# EAGLE design Boobie LS2074M2G (EAGLE 7.7.0)
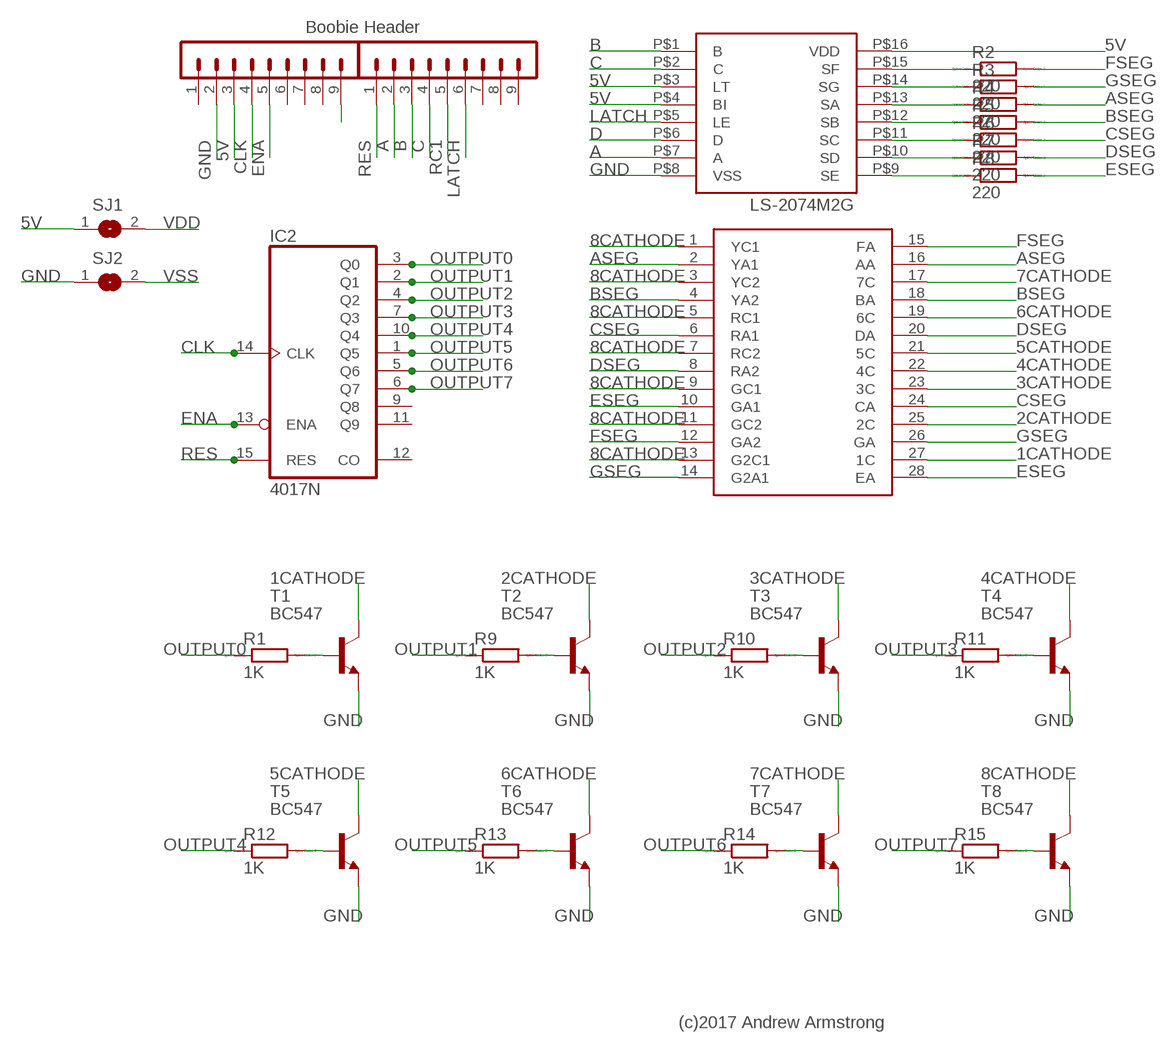
[diagram p0: schematic, sheet 1]

## Parts
IC2  4017N  [DIL16]
R1  1K  R0204/7  [0204/7]
R2  220  R0204/7  [0204/7]
R3  220  R0204/7  [0204/7]
R4  220  R0204/7  [0204/7]
R5  220  R0204/7  [0204/7]
R6  220  R0204/7  [0204/7]
R7  220  R0204/7  [0204/7]
R8  220  R0204/7  [0204/7]
R9  1K  R0204/7  [0204/7]
R10  1K  R0204/7  [0204/7]
R11  1K  R0204/7  [0204/7]
R12  1K  R0204/7  [0204/7]
R13  1K  R0204/7  [0204/7]
R14  1K  R0204/7  [0204/7]
R15  1K  R0204/7  [0204/7]
SJ1  SJ  [SJ]
SJ2  SJ  [SJ]
SV1  MA09-1  [MA09-1]
SV2  MA09-1  [MA09-1]
T1  BC547  [TO92]
T2  BC547  [TO92]
T3  BC547  [TO92]
T4  BC547  [TO92]
T5  BC547  [TO92]
T6  BC547  [TO92]
T7  BC547  [TO92]
T8  BC547  [TO92]
U$1  LS-2074M2G  [LS-2074M2G]
U$2  MC14511B  [DIL16]

## Nets
1CATHODE: T1.3(C) U$1.27(1C)
2CATHODE: T2.3(C) U$1.25(2C)
3CATHODE: T3.3(C) U$1.23(3C)
4CATHODE: T4.3(C) U$1.22(4C)
5CATHODE: T5.3(C) U$1.21(5C)
5V: SJ1.1 SV2.3 U$2.P$3(LT) U$2.P$4(BI) U$2.P$16(VDD)
6CATHODE: T6.3(C) U$1.19(6C)
7CATHODE: T7.3(C) U$1.17(7C)
8CATHODE: T8.3(C) U$1.1(YC1) U$1.3(YC2) U$1.5(RC1) U$1.7(RC2) U$1.9(GC1) U$1.11(GC2) U$1.13(G2C1)
A: SV1.2 U$2.P$7(A)
ASEG: R4.2 U$1.2(YA1) U$1.16(AA)
B: SV1.3 U$2.P$1(B)
BSEG: R5.2 U$1.4(YA2) U$1.18(BA)
C: SV1.4 U$2.P$2(C)
CLK: IC2.14(CLK) SV2.4
CSEG: R6.2 U$1.6(RA1) U$1.24(CA)
D: U$2.P$6(D)
DSEG: R7.2 U$1.8(RA2) U$1.20(DA)
ENA: IC2.13(ENA) SV2.5
ESEG: R8.2 U$1.10(GA1) U$1.28(EA)
FSEG: R2.2 U$1.12(GA2) U$1.15(FA)
GND: SJ2.1 SV2.2 T1.1(E) T2.1(E) T3.1(E) T4.1(E) T5.1(E) T6.1(E) T7.1(E) T8.1(E) U$2.P$8(VSS)
GSEG: R3.2 U$1.14(G2A1) U$1.26(GA)
LATCH: SV1.6 U$2.P$5(LE)
N$1: R9.2 T2.2(B)
N$2: SV2.9
N$3: R10.2 T3.2(B)
N$4: R11.2 T4.2(B)
N$5: R12.2 T5.2(B)
N$6: R13.2 T6.2(B)
N$8: R14.2 T7.2(B)
N$10: R15.2 T8.2(B)
N$16: R1.2 T1.2(B)
N$46: R2.1 U$2.P$15(SF)
N$47: R3.1 U$2.P$14(SG)
N$48: R4.1 U$2.P$13(SA)
N$49: R5.1 U$2.P$12(SB)
N$50: R6.1 U$2.P$11(SC)
N$51: R7.1 U$2.P$10(SD)
N$52: R8.1 U$2.P$9(SE)
OUTPUT0: IC2.3(Q0) R1.1
OUTPUT1: IC2.2(Q1) R9.1
OUTPUT2: IC2.4(Q2) R10.1
OUTPUT3: IC2.7(Q3) R11.1
OUTPUT4: IC2.10(Q4) R12.1
OUTPUT5: IC2.1(Q5) R13.1
OUTPUT6: IC2.5(Q6) R14.1
OUTPUT7: IC2.6(Q7) R15.1
RC1: SV1.5
RES: IC2.15(RES) SV1.1
VDD: SJ1.2
VSS: SJ2.2
Unconnected: IC2.9(Q8) IC2.11(Q9) IC2.12(CO) SV1.7 SV1.8 SV1.9 SV2.1 SV2.6 SV2.7 SV2.8

## Notes on the sheet
- Boobie Header
- (c)2017 Andrew Armstrong

## Power pins joined to a net without a drawn wire
VDD: IC2.16(VDD)
VSS: IC2.8(VSS)

## Library data of the parts
IC2 = 40xx:4017: COUNTER/DIVIDER
R1-R15 = eagle-ltspice:R: RESISTOR, European symbol; SPICEMODEL: NONE; SPICEPREFIX: R
SJ1 SJ2 = jumper:SJ: SMD solder JUMPER
SV1 SV2 = con-lstb:MA09-1: PIN HEADER; OC_FARNELL: unknown; OC_NEWARK: unknown
T1-T8 = transistor:BC547: NPN TRANSISTOR
U$1 = Backoffice Library:LS-2074M2G
U$2 = Backoffice Library:MC14511B

## Net classes
0 default: width 0.5 mm

## Board
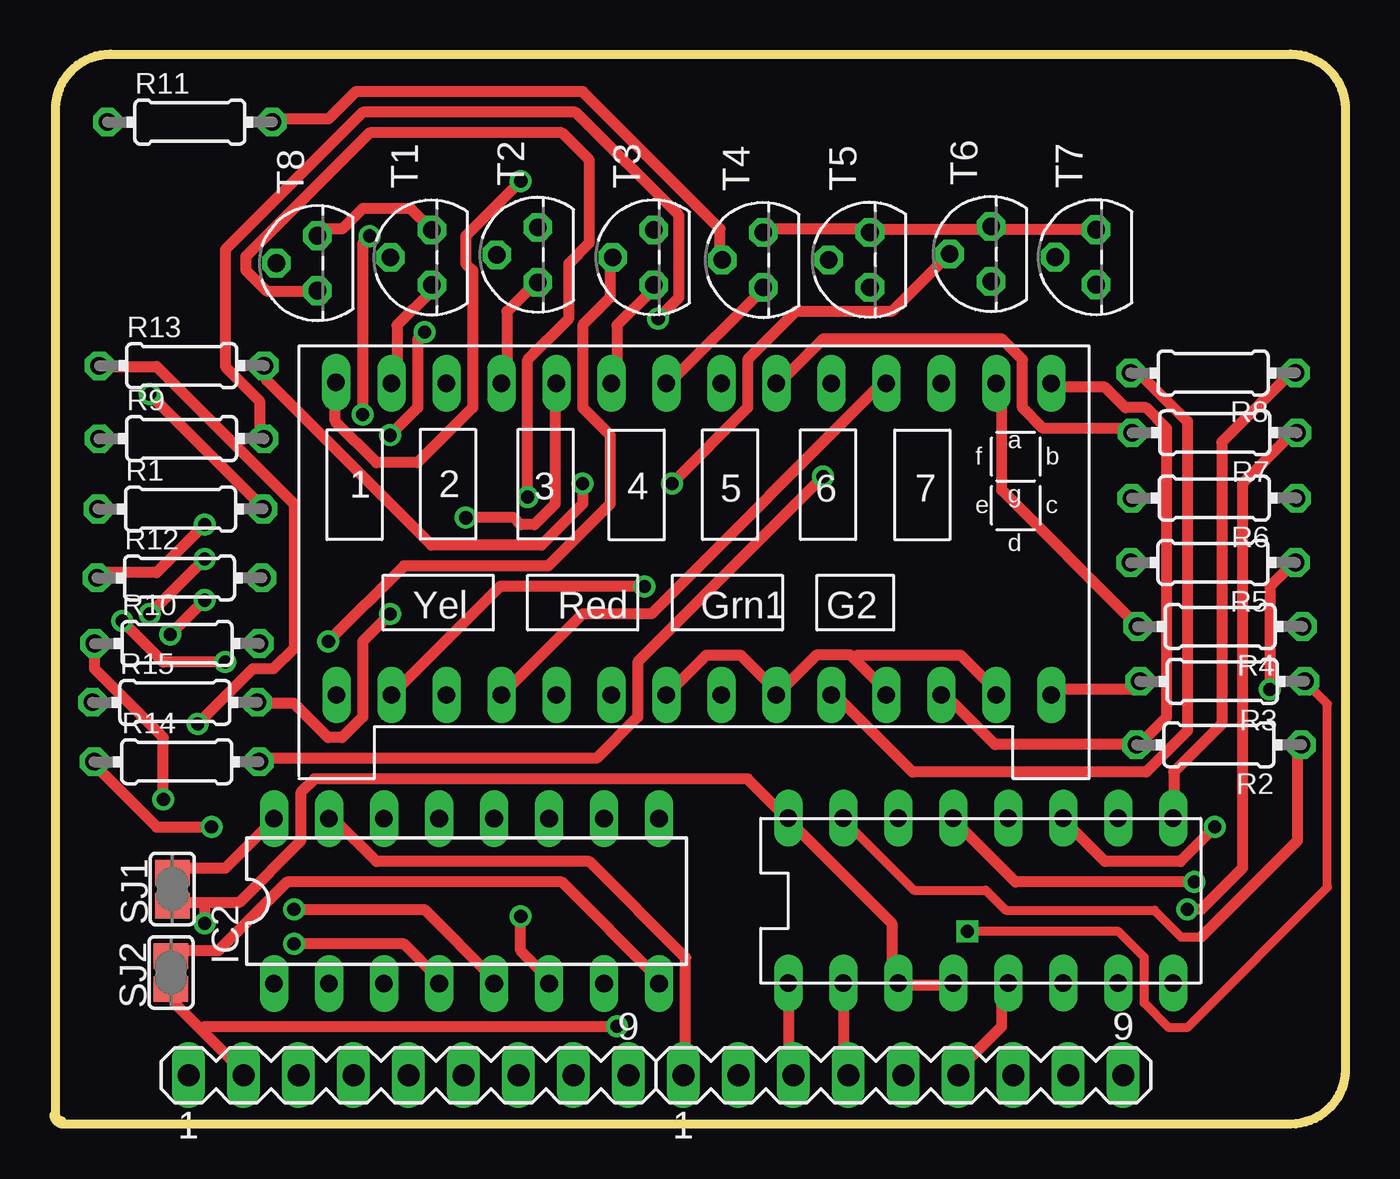
[diagram p1: board, top side]
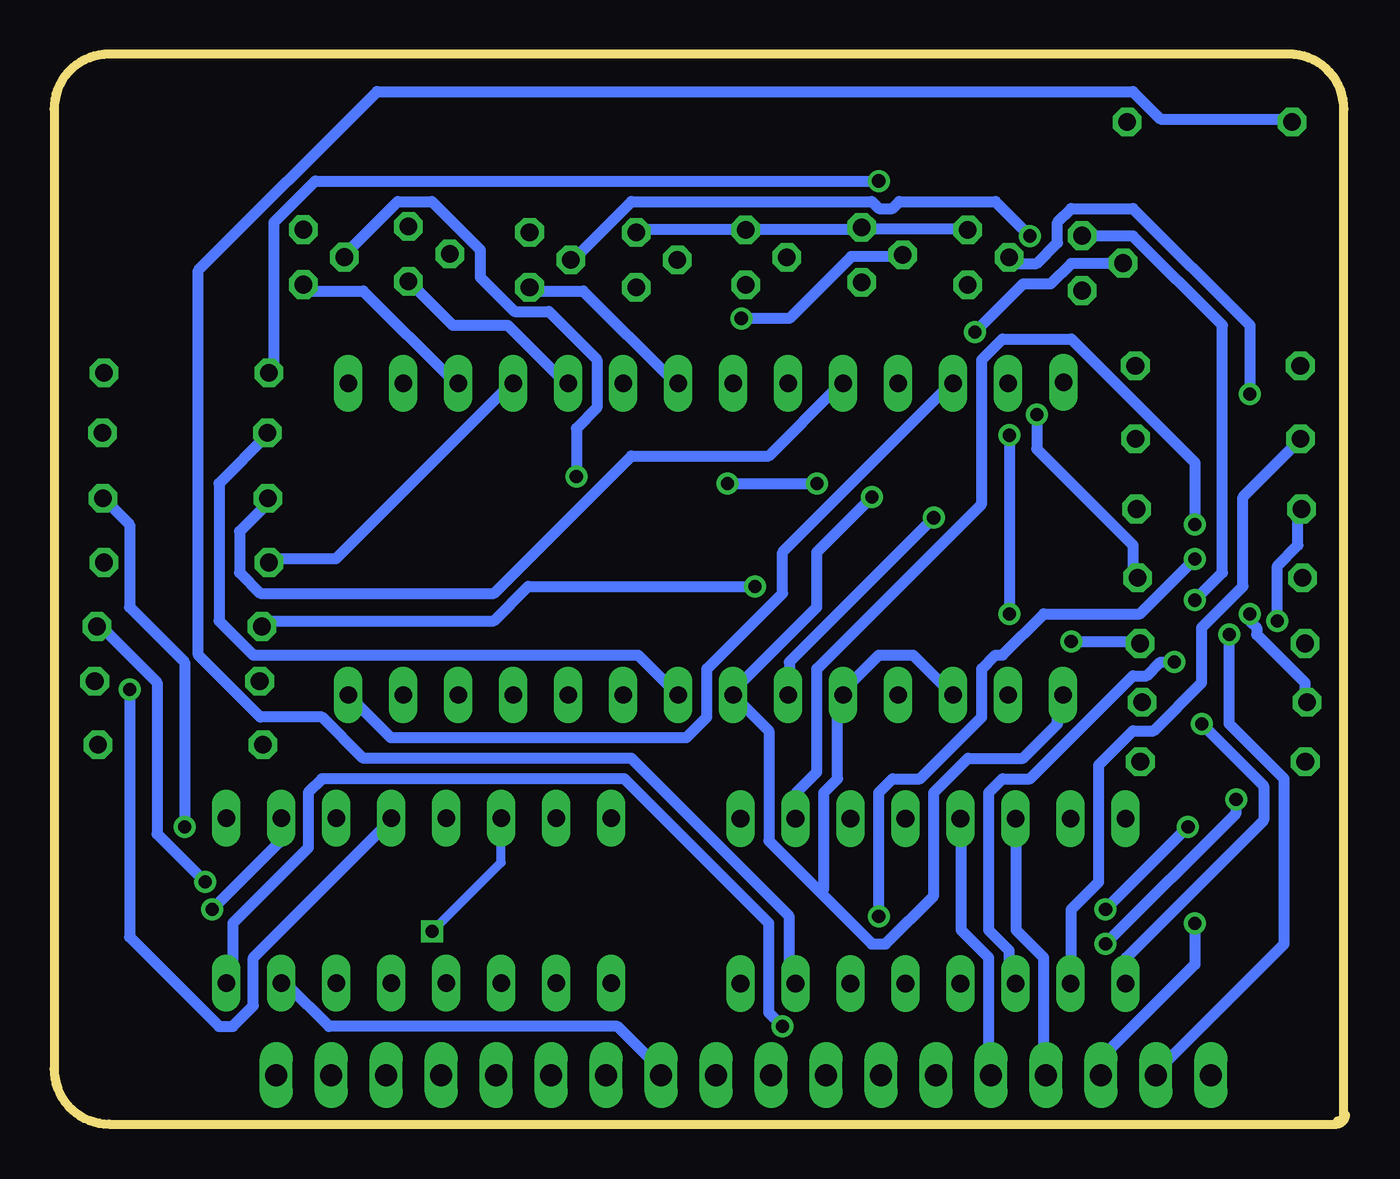
[diagram p2: board, bottom side, seen from below]

Size 59.65 x 49.43 mm. Coordinates in mm from the lower left corner, seen from the top.
Outline: 0.35,0.14 arc-90 0.07,0.43 0.07,46.89 arc-90 2.61,49.43 57.11,49.43 arc-90 59.65,46.89 59.65,2.54 arc-90 57.11,0 0.43,0 arc-90 0,0.43
Copper layers (1*16): Top 0.035mm / dielectric 1.5mm / Bottom 0.035mm
Design rules "default": minimum track width 10mil, minimum drill 24mil, track to track 8mil, track to pad 8mil, pad to pad 8mil, via to via 8mil, smd to smd 8mil, copper to edge 40mil, drill to drill 8mil, minimum pad ring 10mil, minimum via ring 8mil, stop-mask expansion 4mil, vias tented up to drill 0mil, thermal gap 10mil

### Footprints (pad centres in the part's own frame; a part is rotated, then mirrored left to right if it is on the bottom)
DIL16 = drill 0.813 long: 1 -8.89,-3.81; 2 -6.35,-3.81; 3 -3.81,-3.81; 4 -1.27,-3.81; 5 1.27,-3.81; 6 3.81,-3.81; 7 6.35,-3.81; 8 8.89,-3.81; 9 8.89,3.81; 10 6.35,3.81; 11 3.81,3.81; 12 1.27,3.81; 13 -1.27,3.81; 14 -3.81,3.81; 15 -6.35,3.81; 16 -8.89,3.81
0204/7 = drill 0.813 octagon: 1 -3.81,0; 2 3.81,0
SJ = smd 1.168 x 1.6: 1 -0.762,0; 2 0.762,0
MA09-1 = drill 1.016 long: 1 -10.16,0; 2 -7.62,0; 3 -5.08,0; 4 -2.54,0; 5 0,0; 6 2.54,0; 7 5.08,0; 8 7.62,0; 9 10.16,0
TO92 = drill 0.813 octagon: 1 1.27,0; 2 0,1.905; 3 -1.27,0
LS-2074M2G = drill 0.8 long: 1 1.74,-16.14; 2 4.28,-16.14; 3 6.82,-16.14; 4 9.36,-16.14; 5 11.9,-16.14; 6 14.44,-16.14; 7 16.98,-16.14; 8 19.52,-16.14; 9 22.06,-16.14; 10 24.6,-16.14; 11 27.14,-16.14; 12 29.68,-16.14; 13 32.22,-16.14; 14 34.76,-16.14; 15 34.76,-1.74; 16 32.22,-1.74; 17 29.68,-1.74; 18 27.14,-1.74; 19 24.6,-1.74; 20 22.06,-1.74; 21 19.52,-1.74; 22 16.98,-1.74; 23 14.44,-1.74; 24 11.9,-1.74; 25 9.36,-1.74; 26 6.82,-1.74; 27 4.28,-1.74; 28 1.72,-1.7
DIL16' = drill 0.8 long: P$1 -3.81,-3.81; P$2 -1.27,-3.81; P$3 1.27,-3.81; P$4 3.81,-3.81; P$5 6.35,-3.81; P$6 8.89,-3.81; P$7 11.43,-3.81; P$8 13.97,-3.81; P$9 13.97,3.81; P$10 11.43,3.81; P$11 8.89,3.81; P$12 6.35,3.81; P$13 3.81,3.81; P$14 1.27,3.81; P$15 -1.27,3.81; P$16 -3.81,3.81

### Placement (x,y rotation side)
IC2  19.05,10.3 0 top
R1  5.84,28.41 0 top
R2  53.81,17.52 180 top
R3  53.96,20.46 180 top
R4  53.86,22.99 180 top
R5  53.54,25.94 180 top
R6  53.59,28.91 180 top
R7  53.61,31.94 180 top
R8  53.54,34.71 180 top
R9  5.89,31.67 0 top
R10  5.67,22.2 0 top
R11  6.27,46.29 0 top
R12  5.79,25.24 0 top
R13  5.89,35.04 0 top
R14  5.66,16.74 0 top
R15  5.58,19.48 0 top
SJ1  5.46,10.86 90 top
SJ2  5.4,7.01 90 top
SV1  39.23,2.26 0 top
SV2  16.37,2.26 0 top
T1  17.44,40.04 90 top
T2  22.35,40.16 90 top
T3  27.7,40.04 90 top
T4  32.77,39.92 90 top
T5  37.69,39.93 90 top
T6  43.28,40.19 90 top
T7  48.14,40.05 90 top
T8  12.17,39.78 90 top
U$1  11.3,35.96 0 top
U$2  MC14511B  [DIL16']  37.72,10.32 0 top

### Tracks (layer width: path | path; a pad name or v marks a point on that pad's centre or on a via)
1CATHODE
  Top 0.5: U$1.27 15.84,34.36 15.84,36.9 17.43,38.49 T1.3
2CATHODE
  Top 0.5: U$1.25 20.92,34.36 20.92,37.54 22.19,38.81 T2.3
3CATHODE
  Top 0.5: U$1.23 26,34.36 26,36.9 27.59,38.49 T3.3
4CATHODE
  Top 0.5: U$1.22 28.54,34.36 32.67,38.49 T4.3
5CATHODE
  Bottom 0.5: U$1.21 31.08,34.36 35.21,38.49 37.43,38.49 T5.3
5V  (via drill 0.61)
  Top 0.5: U$2.P$4 41.24,6.42 39.02,6.42 U$2.P$3 38.7,6.74 38.7,9.28 33.94,14.04 U$2.P$16 33.62,14.36 32.03,15.95 12.03,15.95 11.4,15.31 11.4,13.09 8.54,10.23 6.95,10.23 | 6.95,10.23 5.68,10.23 SJ1.1 | 6.95,10.23 v6.95,9.28
  Bottom 0.5: v6.95,9.28 6.95,7.37 11.08,3.25 11.08,2.29 SV2.3
6CATHODE
  Bottom 0.5: U$1.19 36.16,34.36 38.7,36.9 41.24,36.9 43.15,38.81 T6.3
7CATHODE
  Bottom 0.5: U$1.17 41.24,34.36 45.37,38.49 47.91,38.49 T7.3
8CATHODE  (via drill 0.61)
  Top 0.5: 36.95,21.5 38.38,20.07 U$1.11 | 36.95,21.5 36.8,21.66 35.21,21.66 33.62,20.07 U$1.9 33.3,20.07 31.72,21.66 30.13,21.66 28.54,20.07 U$1.7 | U$1.13 43.46,20.07 41.88,21.66 37.11,21.66 36.95,21.5 | v21.87,28.96 21.87,35.31 23.78,37.22 23.78,39.76 24.73,40.71 24.73,44.52 23.46,45.79 14.57,45.79 8.86,40.08 8.86,39.44 9.81,38.49 12.03,38.49 T8.3
  Bottom 0.5: U$1.3 18.38,20.07 19.97,21.66 21.56,21.66 23.14,20.07 U$1.5 23.46,19.76 23.46,15.95 24.1,15.31 24.1,10.87 24.25,10.71 | 24.25,10.71 26.64,13.09 26.64,18.17 28.22,19.76 U$1.7 28.22,20.07 24.41,23.88 24.41,26.42 v21.87,28.96 | 24.25,10.71 21.87,8.33 21.24,8.33 19.02,10.55 19.02,15.31 17.43,16.9 14.89,16.9 13.3,18.49 13.3,19.76 U$1.1
A
  Bottom 0.5: U$2.P$7 48.86,6.42 46.96,4.52 33.62,4.52 31.4,2.29 SV1.2
ASEG  (via drill 0.61)
  Top 0.5: v27.27,24.84 20.6,24.84 15.84,20.07 U$1.2 | U$1.16 43.78,34.04 43.78,29.28 49.81,23.25 R4.2
  Bottom 0.5: v27.27,24.84 37.75,24.84 39.34,23.25 49.81,23.25 R4.2
B
  Top 0.5: U$2.P$1 33.94,6.42 33.94,2.29 SV1.3
BSEG
  Top 0.5: U$1.4 20.92,20.07 24.41,23.57 27.59,23.57 38.38,34.36 U$1.18
  Bottom 0.5: R5.2 49.5,26.11 46.64,26.11 38.7,34.04 U$1.18
C
  Top 0.5: U$2.P$2 36.48,6.42 36.48,2.29 SV1.4
CLK
  Bottom 0.5: IC2.14 15.21,14.04 15.21,8.96 13.94,7.69 13.94,2.29 SV2.4
CSEG  (via drill 0.61)
  Top 0.5: v19.02,28.01 21.24,28.01 21.56,27.69 22.19,27.69 23.14,28.65 23.14,34.04 U$1.24
  Bottom 0.5: U$1.24 23.46,34.04 26.64,30.87 32.99,30.87 39.34,24.52 50.13,24.52 51.08,25.47 51.08,27.38 49.81,28.65 R6.2 | v19.02,28.01 25.68,21.34 25.68,20.07 U$1.6
DSEG
  Top 0.5: U$1.20 33.62,34.36 35.53,36.27 43.78,36.27 44.73,35.31 44.73,33.09 45.69,32.14 49.5,32.14 R7.2
  Bottom 0.5: U$1.8 31.08,20.07 32.67,21.66 50.45,21.66 52.04,23.25 52.04,29.6 49.81,31.82 R7.2
ENA
  Bottom 0.5: IC2.13 17.75,14.04 17.75,8.96 16.48,7.69 16.48,2.29 SV2.5
ESEG  (via drill 0.61)
  Top 0.5: U$1.10 36.16,19.76 39.65,16.26 50.45,16.26 52.35,18.17 52.35,32.46 49.81,35 R8.2 | v21.56,43.57 19.02,41.03 19.02,39.76 19.33,39.44 19.33,33.09 16.79,30.55 14.89,30.55 12.98,32.46 12.98,34.04 U$1.28
  Bottom 0.5: v21.56,43.57 47.59,43.57 49.5,41.66 49.5,35 R8.2
FSEG
  Top 0.5: U$1.12 41.24,19.76 43.46,17.53 49.81,17.53 R2.2 50.13,17.53 51.4,18.8 51.4,32.14 50.45,33.09 49.5,33.09 48.54,34.04 46.32,34.04 U$1.15
GND  (via drill 0.61)
  Top 0.5: T8.1 12.35,41.35 13.3,41.35 14.25,42.3 16.48,42.3 17.43,41.35 T1.1 | T7.1 47.91,41.35 43.46,41.35 T6.1 43.15,41.35 37.75,41.35 T5.1 37.43,41.35 32.99,41.35 T4.1 | 6.79,4.36 8.86,2.29 SV2.2 | 6.79,4.36 5.68,5.47 5.68,6.1 SJ2.1 | v26,4.52 6.95,4.52 6.79,4.36 | v5.36,22.61 v6.95,24.2
  Bottom 0.5: T1.1 17.75,41.35 22.19,41.35 T2.1 22.51,41.35 27.59,41.35 T3.1 27.91,41.35 32.67,41.35 T4.1 | v26,4.52 26.64,5.15 26.64,9.28 33.3,15.95 47.27,15.95 47.91,15.31 47.91,12.77 51.4,9.28 51.4,6.74 U$2.P$8 | v6.95,24.2 5.68,25.47 5.68,36.9 9.81,41.03 12.03,41.03 T8.1 | v5.36,22.61 5.36,18.49 2.82,15.95 2.82,8.33 8.86,2.29 SV2.2
GSEG
  Top 0.5: U$1.14 46.32,20.07 49.81,20.07 50.13,20.39 R3.2
  Bottom 0.5: U$1.26 18.38,34.04 26,26.42 26,24.52 29.49,21.03 29.49,18.8 30.45,17.85 44.1,17.85 46,19.76 U$1.14
LATCH
  Top 0.5: U$2.P$5 43.78,6.42 43.78,4.52 41.56,2.29 SV1.6
N$1  (via drill 0.61)
  Top 0.5: v27.91,37.22 28.86,38.17 28.86,41.98 24.1,46.74 14.25,46.74 7.9,40.39 7.9,35 9.49,33.41 9.49,31.82 R9.2
  Bottom 0.5: v27.91,37.22 25.68,37.22 22.83,40.08 20.6,40.08 T2.2
N$3  (via drill 0.61)
  Top 0.5: v12.67,22.3 16.16,25.79 22.83,25.79 25.68,28.65 25.68,31.82 24.41,33.09 24.41,36.9 25.68,38.17 25.68,39.76 T3.2
  Bottom 0.5: v12.67,22.3 9.49,22.3 R10.2
N$4
  Top 0.5: R11.2 10.13,46.43 12.67,46.43 13.94,47.7 24.41,47.7 30.76,41.35 30.76,40.08 T4.2
N$5  (via drill 0.61)
  Top 0.5: v14.25,32.77 14.25,40.71 v14.57,41.03
  Bottom 0.5: v14.25,32.77 14.25,31.19 9.81,26.74 9.81,25.47 R12.2 | v14.57,41.03 16.16,42.62 20.6,42.62 20.92,42.3 21.56,42.3 21.87,42.62 32.99,42.62 35.53,40.08 T5.2
N$6  (via drill 0.61)
  Top 0.5: v24.41,29.6 24.41,28.65 22.51,26.74 17.43,26.74 9.81,34.36 9.81,35 R13.2 | v28.54,29.6 32.03,33.09 32.03,35.31 34.26,37.54 38.7,37.54 41.24,40.08 T6.2
  Bottom 0.5: v28.54,29.6 v24.41,29.6
N$7
  Top 0.406: 5.49,11.7 5.43,11.7 5.43,10.17
N$8  (via drill 0.61)
  Top 0.5: v35.53,29.92 26.95,21.34 26.95,18.8 25.05,16.9 9.49,16.9 R14.2
  Bottom 0.5: v35.53,29.92 35.53,32.14 34.57,33.09 34.57,35.31 36.8,37.54 38.38,37.54 39.97,39.12 39.97,40.39 42.19,42.62 43.78,42.62 46.32,40.08 T7.2
N$9
  Top 0.406: 5.33,7.97 5.41,7.97 5.41,6.07
N$10  (via drill 0.61)
  Top 0.5: v15.52,23.57 14.25,22.3 14.25,18.8 13.3,17.85 12.67,17.85 11.08,19.44 9.49,19.44 R15.2 | v15.52,31.82 16.79,33.09 16.79,36.27 v17.11,36.58
  Bottom 0.5: v15.52,31.82 v15.52,23.57 | v17.11,36.58 14.89,38.81 13.62,38.81 12.67,39.76 10.44,39.76 T8.2
N$16  (via drill 0.61)
  Top 0.5: v4.41,33.73 9.49,28.65 R1.2
  Bottom 0.5: v4.41,33.73 4.41,36.9 9.81,42.3 12.67,42.3 13.3,41.66 13.3,40.71 14.25,39.76 15.52,39.76 T1.2
N$46
  Top 0.406: 36.48,14.04 39.72,10.8 43.04,10.8 43.97,9.87 50.83,9.87 52.06,8.64 52.99,8.64
  Top 0.5: 52.99,8.64 57.43,13.09 57.43,17.22 R2.1 | 36.48,14.04 U$2.P$15
N$47  (via drill 0.6)
  Top 0.406: R3.1 58.82,19.41 58.82,10.94 52.34,4.45 51.49,4.45 50.35,5.59 50.35,7.71 49.17,8.9 v42.18,8.9
  Bottom 0.406: v42.18,8.9 38.99,12.09 U$2.P$14
N$48  (via drill 0.61)
  Top 0.5: v52.67,11.18 44.42,11.18 41.56,14.04 U$2.P$13
  Bottom 0.5: v52.67,11.18 54.89,13.41 54.89,20.39 57.43,22.93 R4.1
N$49  (via drill 0.61)
  Top 0.5: v56.16,20.07 56.16,24.84 57.12,25.79 R5.1
  Bottom 0.5: v56.16,20.07 56.16,8.64 52.04,4.52 51.4,4.52 50.45,5.47 50.45,7.69 44.1,14.04 U$2.P$12
N$50  (via drill 0.61)
  Top 0.5: v53.62,13.72 52.04,12.14 48.54,12.14 46.64,14.04 U$2.P$11
  Bottom 0.5: v53.62,13.72 53.62,21.34 56.16,23.88 56.16,27.69 57.12,28.65 R6.1
N$51  (via drill 0.61)
  Top 0.5: v52.35,9.91 52.99,9.91 54.89,11.82 54.89,29.6 57.12,31.82 R7.1
  Bottom 0.5: v52.35,9.91 49.18,13.09 49.18,14.04 U$2.P$10
N$52
  Top 0.5: U$2.P$9 51.72,14.36 51.72,16.26 53.94,18.49 53.94,31.5 57.12,34.68 R8.1
OUTPUT0  (via drill 0.61)
  Top 0.5: v3.14,23.25 5.05,21.34 v7.9,21.34
  Bottom 0.5: v3.14,23.25 3.14,25.79 2.19,26.74 2.19,28.33 R1.1 | v7.9,21.34 8.54,21.34 9.17,20.71 9.81,20.71 14.57,15.95 15.84,15.95 16.48,15.31 16.48,8.96 15.52,8.01 15.52,6.74 IC2.3
OUTPUT1
  Bottom 0.5: R9.1 2.19,31.5 4.73,28.96 4.73,24.84 6.63,22.93 6.63,20.39 8.86,18.17 9.81,18.17 11.4,16.58 11.4,11.18 12.67,9.91 12.67,6.74 IC2.2
OUTPUT2  (via drill 0.61)
  Top 0.5: v5.05,14.99 5.05,17.85 1.87,21.03 1.87,21.98 R10.1 | v11.08,8.33 16.16,8.33 17.75,6.74 IC2.4
  Bottom 0.5: v5.05,14.99 5.05,14.36 v11.08,8.33
OUTPUT3
  Bottom 0.5: R11.1 2.51,46.43 8.54,46.43 9.81,47.7 44.73,47.7 52.99,39.44 52.99,21.66 50.13,18.8 47.27,18.8 45.37,16.9 32.99,16.9 25.68,9.6 25.68,6.74 IC2.7
OUTPUT4  (via drill 0.61)
  Top 0.5: v6.95,27.69 4.73,25.47 2.19,25.47 R12.1
  Bottom 0.5: v6.95,27.69 6.95,30.55 12.67,36.27 15.84,36.27 16.79,35.31 16.79,28.65 24.41,21.03 24.41,16.26 25.37,15.31 25.37,14.36 IC2.10
OUTPUT5  (via drill 0.61)
  Top 0.5: v6.63,18.49 9.17,21.03 10.13,21.03 11.08,21.98 11.08,28.65 4.73,35 2.19,35 R13.1
  Bottom 0.5: v6.63,18.49 3.78,15.63 3.78,14.04 10.13,7.69 10.13,6.74 IC2.1
OUTPUT6  (via drill 0.61)
  Top 0.5: v11.08,9.91 17.11,9.91 20.29,6.74 IC2.5 | v7.27,13.72 4.73,13.72 1.87,16.58 R14.1
  Bottom 0.5: v7.27,13.72 v11.08,9.91
OUTPUT7  (via drill 0.61)
  Top 0.5: v6.95,26.11 v4.41,23.57 | v21.56,9.6 21.56,8.01 22.83,6.74 IC2.6
  Bottom 0.5: v4.41,23.57 4.41,23.25 4.09,22.93 4.09,22.61 1.87,20.39 1.87,19.76 R15.1 | v6.95,26.11 9.49,23.57 13.94,23.57 15.84,21.66 16.16,21.66 16.79,21.03 16.79,18.8 19.65,15.95 20.92,15.95 21.56,15.31 v21.56,9.6
RES
  Top 0.5: IC2.15 12.98,14.04 14.89,12.14 24.73,12.14 29.18,7.69 29.18,2.29 SV1.1
VDD
  Top 0.5: SJ1.2 5.68,11.82 7.9,11.82 10.13,14.04 IC2.16
VSS
  Top 0.5: SJ2.2 5.68,8.01 7.59,8.01 10.76,11.18 23.46,11.18 27.91,6.74 IC2.8